# EAGLE design STM32-NRF24L01 (EAGLE 9.5.1)
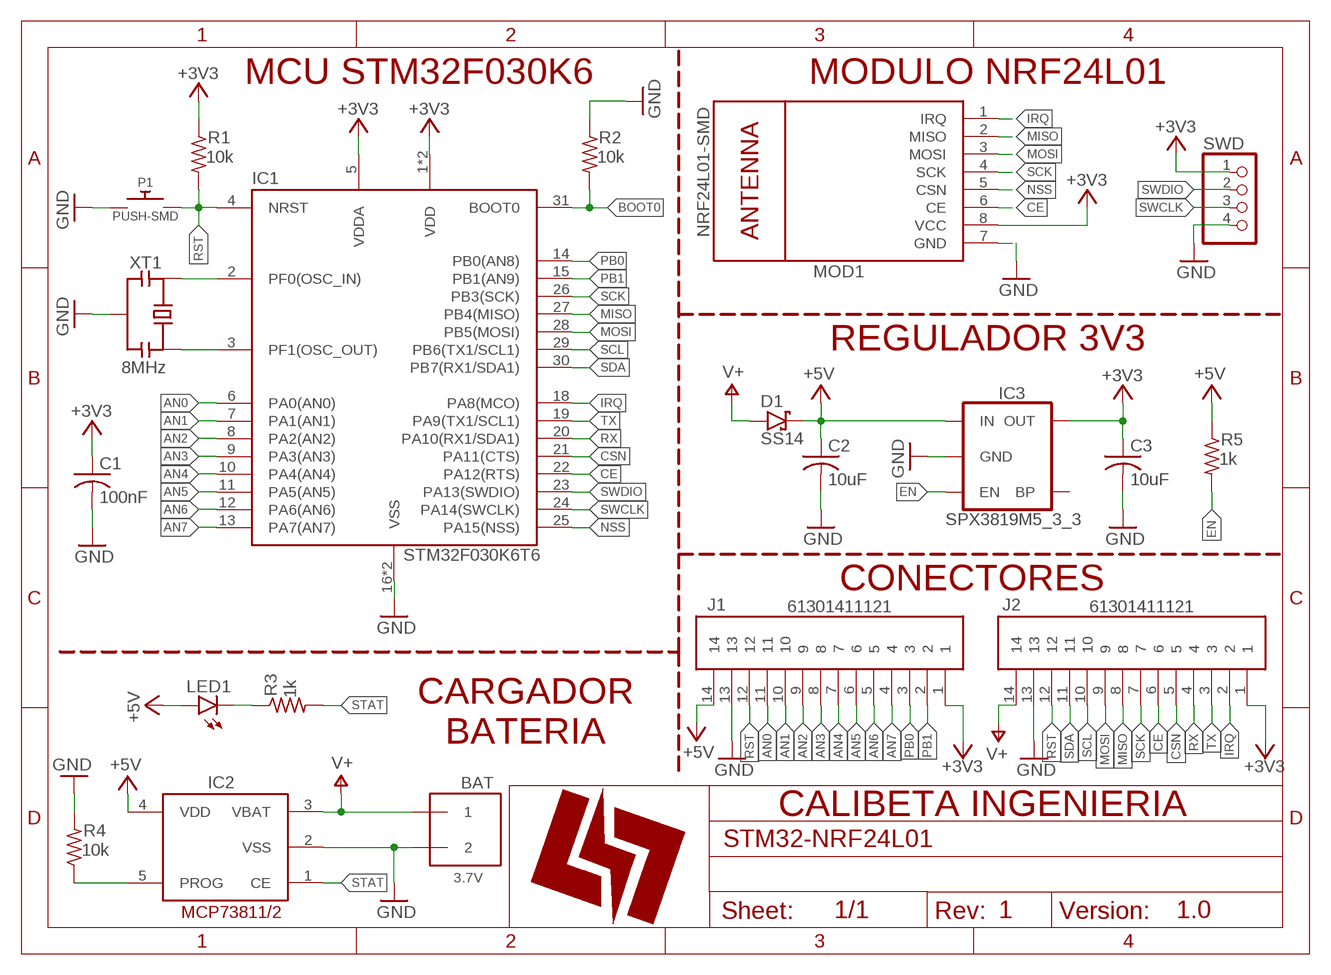
[diagram p0: schematic, sheet 1]

## Parts
BAT  3.7V  JST-2PIN-PH-SM4  [S2B-PH-SM4]
C1  100nF  CAPC0805  [C0805]
C2  10uF  CAPC0805  [C0805]
C3  10uF  CAPC0805  [C0805]
D1  SS14  [DO-214AC]
IC1  STM32F030K6T6  [LQFP32]
IC2  MCP73811/2  [SOT23-5L]
IC3  SPX3819M5_3_3  V_REG_SPX3819-SOT23-5  [SOT23-5]
J1  61301411121  [61301411121]
J2  61301411121  [61301411121]
LED1  LED-ROJO0805  [LED0805-ROJO]
MOD1  NRF24L01-SMD  [NRF24L01-SMD]
P1  PUSH-SMD  PULSADOR-SMD-6035  [ST-SMD-6X3.5MM]
R1  10k  RESISTOR_R0805  [R0805]
R2  10k  RESISTOR_R0805  [R0805]
R3  1k  RESISTOR_R0805  [R0805]
R4  10k  RESISTOR_R0805  [R0805]
R5  1k  RESISTOR_R0805  [R0805]
SWD  PINHD-1X4/90  [1X04/90]
U$1  A5_H-LOGO  [LOGO-10MM]
XT1  8MHz  CSTNE8M00G55-R0  [3-SMD]

## Nets
+3V3: C1.1 C3.1 IC1.1(VDD) IC1.5(VDDA) IC1.17(VDD) IC3.5(OUT) J1.1 J2.1 MOD1.8(VCC) R1.1 SWD.1
+5V: C2.1 D1.K IC2.4(VDD) IC3.1(IN) J1.14 LED1.A R5.1
AN0: IC1.6(PA0(AN0)) J1.11
AN1: IC1.7(PA1(AN1)) J1.10
AN2: IC1.8(PA2(AN2)) J1.9
AN3: IC1.9(PA3(AN3)) J1.8
AN4: IC1.10(PA4(AN4)) J1.7
AN5: IC1.11(PA5(AN5)) J1.6
AN6: IC1.12(PA6(AN6)) J1.5
AN7: IC1.13(PA7(AN7)) J1.4
BOOT0: IC1.31(BOOT0) R2.2
CE: IC1.22(PA12(RTS)) J2.6 MOD1.6(CE)
CSN: IC1.21(PA11(CTS)) J2.5
EN: IC3.3(EN) R5.2
GND: BAT.2 C1.2 C2.2 C3.2 IC1.16(VSS) IC1.32(VSS) IC2.2(VSS) IC3.2(GND) J1.13 J2.13 MOD1.7(GND) P1.1 R2.1 R4.2 SWD.4 XT1.2(GND)
IRQ: IC1.18(PA8(MCO)) J2.2 MOD1.1(IRQ)
MISO: IC1.27(PB4(MISO)) J2.8 MOD1.2(MISO)
MOSI: IC1.28(PB5(MOSI)) J2.9 MOD1.3(MOSI)
N$1: IC1.2(PF0(OSC_IN)) XT1.1(X1)
N$2: IC1.3(PF1(OSC_OUT)) XT1.3(X2)
N$7: LED1.C R3.1
N$8: IC2.5(PROG) R4.1
NSS: IC1.25(PA15(NSS)) MOD1.5(CSN)
PB0: IC1.14(PB0(AN8)) J1.3
PB1: IC1.15(PB1(AN9)) J1.2
RST: IC1.4(NRST) J1.12 J2.12 P1.2 R1.2
RX: IC1.20(PA10(RX1/SDA1)) J2.4
SCK: IC1.26(PB3(SCK)) J2.7 MOD1.4(SCK)
SCL: IC1.29(PB6(TX1/SCL1)) J2.10
SDA: IC1.30(PB7(RX1/SDA1)) J2.11
STAT: IC2.1(CE) R3.2
SWCLK: IC1.24(PA14(SWCLK)) SWD.3
SWDIO: IC1.23(PA13(SWDIO)) SWD.2
TX: IC1.19(PA9(TX1/SCL1)) J2.3
V+: BAT.1 D1.A IC2.3(VBAT) J2.14
Unconnected: IC3.4(BP)

## Notes on the sheet
- MCU STM32F030K6 | MODULO NRF24L01
- REGULADOR 3V3
- CONECTORES
- CARGADOR
  BATERIA
- 1 | 1.0

## Library data of the parts
BAT = CaliBeta-Conectores:JST-2PIN: Conector JST 2mm pitch de 2 pines, Imax 2A Datasheet <http://www.jst-mfg.com/product/pdf/eng/ePH.pdf>
C1-C3 = CaliBeta-RCL:CAP: Capacitor ceramico multicapa
D1 = CaliBeta-Diodos:SS14: Diodo de barrera Schottky (1N5819 SMD) (VRRM): 40V, IRMS: 1A
IC1 = CaliBeta-Microcontroladores:STM32F030K6: Microcontrolador STM de 32 bits, arquitecturs ARM 32KB FLASH 4 KB SRAM 26 General Purpose I/O pins 6-channels 16-bit PWM 10-channels 2-12-bit A/D 1 SPI 1 I2C 1 UART Datasheet <https://www.st.com/resource/en/datasheet/dm00088500.pdf>
IC2 = adafruit:MCP73811/2: MCP73811 and MCP73812 Simple, Miniature Single-Cell, Fully Integrated Li-Ion / Li-Polymer Charge Management Controllers SOT-23-5 package, no indicator LED but with adjustable current, small and very inexpensive
IC3 = SparkFun-IC-Power:V_REG_SPX3819: SPX3819 Voltage Regulator 3.3V 500mA, 16V input Datasheet <https://www.exar.com/content/document.ashx?id=22106> SparkFun Products: SparkFun Serial Controlled Motor Driver <https://www.sparkfun.com/products/13911>; PROD_ID: VREG-13321
J1 J2 = Headers:61301411121: CONN HEADER VERT 14POS 2.54MM Manufacturer's datasheet <https://katalog.we-online.de/em/datasheet/6130xx11121.pdf>; CREATED_BY: PCBLayout.com; DIGIKEY_PART_NUMBER: 732-5325-ND; MANUFACTURER: Wurth Electronics Inc.; MPN: 61301411121
LED1 = CaliBeta-Diodos:LED-ROJO: LED SMD Imax:20mA, color Rojo
MOD1 = CaliBeta-Modulos:NRF24L01: Modulo inalambrico de 2.4GHz basado en el integrado NRF24L01 Mas detalles disponibles aqui: http://www.electrodragon.com/w/NRF24L01
P1 = CaliBeta-Miselaneos:PULSADOR-
R1-R5 = CaliBeta-RCL:RESISTOR_: RESISTOR, simbolo Americano
SWD = pinhead:PINHD-1X4: PIN HEADER
U$1 = CaliBeta-Estilos:A5_H-LOGO
XT1 = CaliBeta-Cristales:CSTNE8M00G55-R0: Crystal ceramico resonador fabricado con capacitor, 8MHz - 33pF, ±0.5% - 40 Ohm Datasheet <https://www.murata.com/~/media/webrenewal/support/library/catalog/products/timingdevice/ceralock/p17e.ashx>

## Board
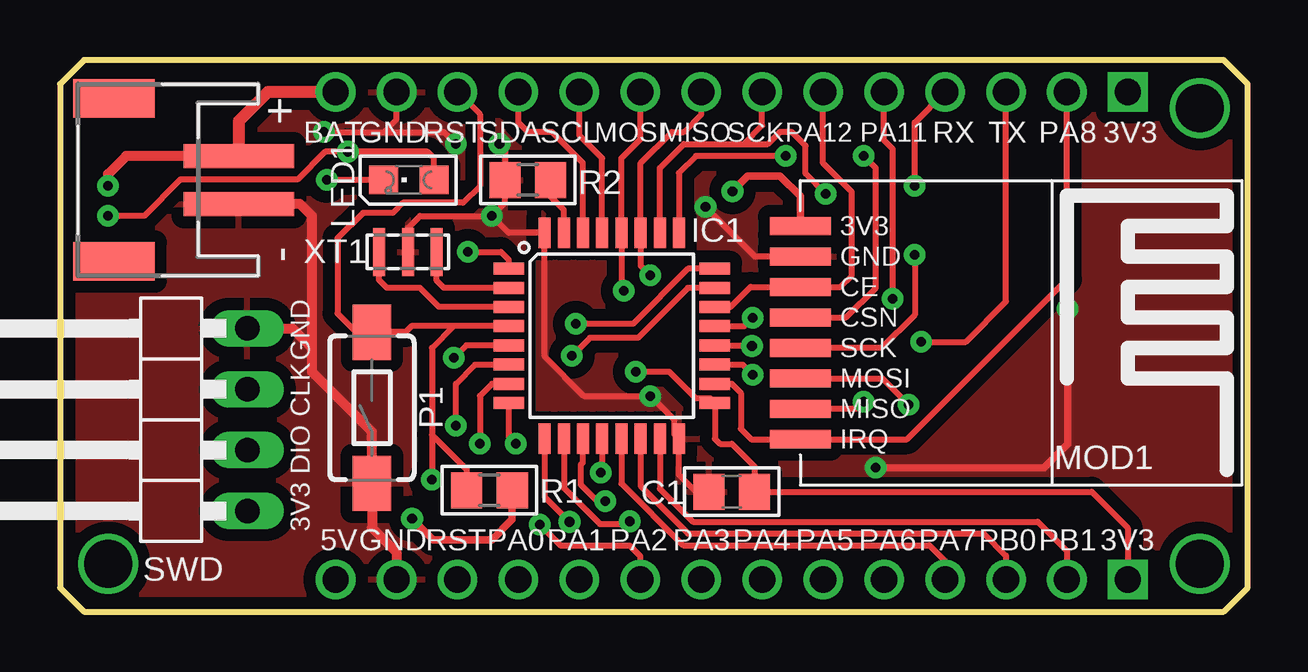
[diagram p1: board, top side]
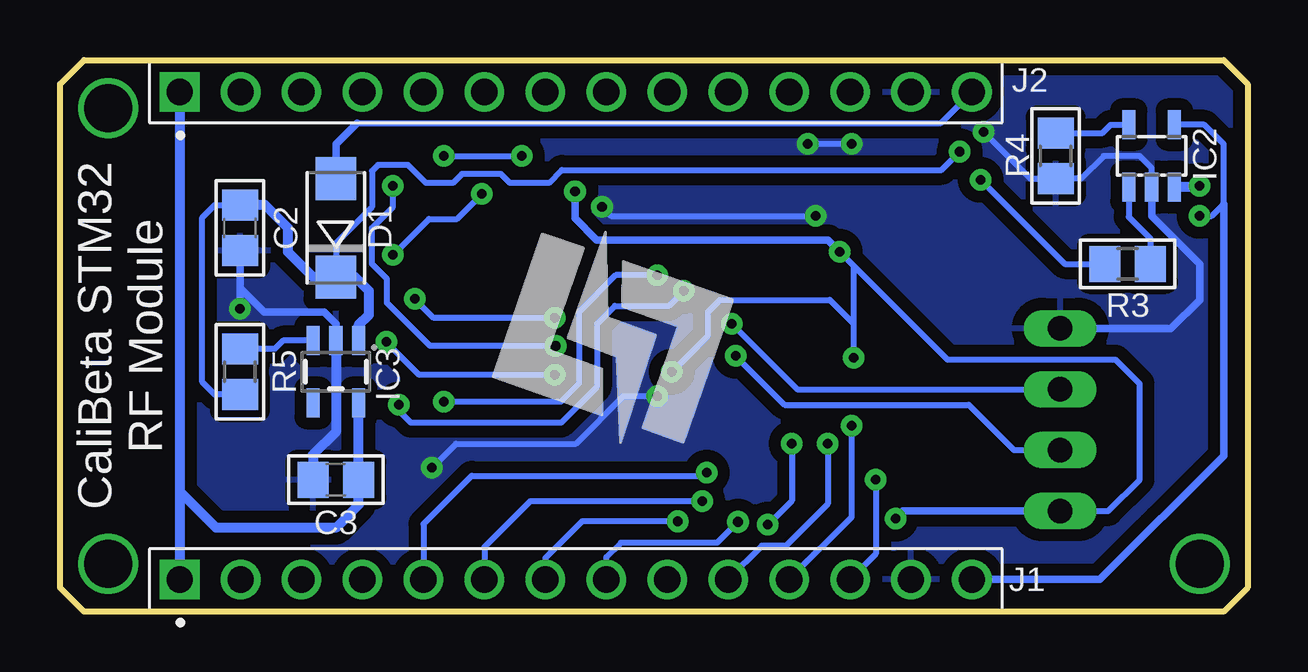
[diagram p2: board, bottom side, seen from below]

Size 49.5 x 23 mm. Coordinates in mm from the lower left corner, seen from the top.
Outline: 1,0 48.5,0 49.5,1 49.5,22 48.5,23 1,23 0,22 0,1 1,0
Copper layers (1*16): Top 0.035mm / dielectric 1.5mm / Bottom 0.035mm
Design rules "China_JLCPCB *": minimum track width 0.25mm, minimum drill 0.4mm, track to track 0.24mm, track to pad 0.23mm, pad to pad 0.2mm, via to via 0.25mm, smd to smd 0.2mm, copper to edge 0.35mm, drill to drill 0.3mm, minimum pad ring 0.25mm, minimum via ring 0.25mm, stop-mask expansion 3mil, vias tented up to drill 0.6mm, thermal gap 20mil

### Footprints (pad centres in the part's own frame; a part is rotated, then mirrored left to right if it is on the bottom)
S2B-PH-SM4 = smd 1 x 4.6: 1 1,-3.7; 2 -1,-3.7 | smd 1.6 x 3.4: NC1 -3.4,1.5; NC2 3.4,1.5
C0805 = smd 1.3 x 1.5: 1 -0.95,0; 2 0.95,0
DO-214AC = smd 1.8 x 1.7: A 2.05,0; K -2.05,0
LQFP32 = smd 1.27 x 0.5: 1 -4.293,2.8; 2 -4.293,2; 3 -4.293,1.2; 4 -4.293,0.4; 5 -4.293,-0.4; 6 -4.293,-1.2; 7 -4.293,-2; 8 -4.293,-2.8; 17 4.293,-2.8; 18 4.293,-2; 19 4.293,-1.2; 20 4.293,-0.4; 21 4.293,0.4; 22 4.293,1.2; 23 4.293,2; 24 4.293,2.8 | smd 0.5 x 1.27: 9 -2.8,-4.293; 10 -2,-4.293; 11 -1.2,-4.293; 12 -0.4,-4.293; 13 0.4,-4.293; 14 1.2,-4.293; 15 2,-4.293; 16 2.8,-4.293; 25 2.8,4.293; 26 2,4.293; 27 1.2,4.293; 28 0.4,4.293; 29 -0.4,4.293; 30 -1.2,4.293; 31 -2,4.293; 32 -2.8,4.293
SOT23-5L = smd 0.55 x 1.2: 1 -0.95,-1.3; 2 0,-1.3; 3 0.95,-1.3; 4 0.95,1.3; 5 -0.95,1.3
SOT23-5 = smd 0.55 x 1.2: 1 -0.95,-1.3; 2 0,-1.3; 3 0.95,-1.3; 4 0.95,1.3; 5 -0.95,1.3
61301411121 = drill 1.1 square: 1 -16.51,0 | drill 1.1: 2 -13.97,0; 3 -11.43,0; 4 -8.89,0; 5 -6.35,0; 6 -3.81,0; 7 -1.27,0; 8 1.27,0; 9 3.81,0; 10 6.35,0; 11 8.89,0; 12 11.43,0; 13 13.97,0; 14 16.51,0
LED0805-ROJO = smd 1.2 x 1.2: A 1.09,0; C -1.01,0
NRF24L01-SMD = smd 2.54 x 0.762: 1 -9.144,-4.318; 2 -9.144,-3.048; 3 -9.144,-1.778; 4 -9.144,-0.508; 5 -9.144,0.762; 6 -9.144,2.032; 7 -9.144,3.302; 8 -9.144,4.572
ST-SMD-6X3.5MM = smd 2.3 x 1.6: 1 -3.15,0; 2 3.15,0
R0805 = smd 1.3 x 1.5: 1 -0.95,0; 2 0.95,0
1X04/90 = drill 1.016 long: 1 -3.81,-3.81; 2 -1.27,-3.81; 3 1.27,-3.81; 4 3.81,-3.81
3-SMD = smd 0.5 x 2: 1 1.2,0; 2 0,0; 3 -1.2,0

### Placement (x,y rotation side)
BAT  3.75,18 90 top
C1  28,5 180 top
C2  42,16 270 bottom
C3  38,5.5 180 bottom
D1  38,16 90 bottom
IC1  23,11.5 0 top
IC2  4,19 0 bottom
IC3  38,10 180 bottom
J1  28,1.34 0 bottom
J2  28,21.66 0 bottom
LED1  14.5,18 0 top
MOD1  40,11.5 0 top
P1  13,8.5 90 top
R1  17.9,5.06 180 top
R2  19.5,18 0 top
R3  5,14.5 0 bottom
R4  8,19 270 bottom
R5  42,10 90 bottom
SWD  4,8 90 top
U$1  26.5,11.5 0 bottom
XT1  14.5,15 0 top

### Tracks (layer width: path | path; a pad name or v marks a point on that pad's centre or on a via)
+3V3  (via drill 0.4)
  Top 0.25: J1.1 44.51,3.49 43,5 C1.1 28.95,6.05 28,7 27.5,7 27.29,7.21 IC1.17 27.1,8.89 26.51,8.89 25.41,10 v24,10 | IC1.5 16.93,11.1 v16.42,10.58 | IC1.1 18.71,14.67 18.38,15 v17,15
  Top 0.305: R1.1 18.85,3.85 18,3 15.55,3 v14.68,3.88 | MOD1.8 30.86,17.31 30.02,18.15 28.66,18.15 v28.03,17.52
  Bottom 0.25: v16.42,10.58 16.42,12 | 16.42,12 16.42,14.42 | 16.42,14.42 v17,15 | SWD.1 5.81,4.19 4.5,5.5 4.5,9.5 5.5,10.5 12.5,10.5 16.42,14.42 | v24,10 22.5,11.5 22.5,12.5 22,13 17.42,13 16.42,12
  Bottom 0.305: v14.68,3.88 14.36,4.19 SWD.1 | v28.03,17.52 28.03,16.4 27.13,15.5 17.5,15.5 v17,15
  Bottom 0.406: IC3.5 C3.1 37.05,4.45 38,3.5 43,3.5 44.51,5.01 | J2.1 44.51,5.01 | 44.51,5.01 J1.1
+5V  (via drill 0.4)
  Top 0.25: v2,16.5 3.5,16.5 5.02,18.02 9.9,18.02 11.05,19.18 v12,19.18 15.32,19.18 15.59,18.91 LED1.A
  Bottom 0.25: v2,16.5 1.5,16.5 1,17 1,19.5 1.8,20.3 IC2.4 | D1.K 38,15.38 36.5,16.88 36.5,18.38 36.25,18.62 35,18.62 34.25,17.88 33.12,17.88 32.75,18.25 31.12,18.25 30.75,17.88 29.12,17.88 28.59,18.41 12.76,18.41 v12,19.18 | R5.1 43.05,9.05 43.57,9.57 43.57,16.43 43.05,16.95 C2.1
  Bottom 0.305: J1.14 6.16,1.34 1,6.5 1,17
  Bottom 0.406: IC3.1 37.05,11.95 36.62,12.38 36.62,13.38 37.2,13.95 D1.K 38.95,13.95 40,15 40,16 40.95,16.95 C2.1
AN0  (via drill 0.4)
  Top 0.25: v16.5,7.75 16.5,9.5 17.3,10.3 IC1.6
  Bottom 0.25: J1.11 16.5,3.95 v16.5,7.75
AN1  (via drill 0.4)
  Top 0.25: IC1.7 18,9.5 17.5,9 v17.5,7
  Bottom 0.25: v17.5,7 17.5,4.5 19.25,2.75 20.25,2.75 J1.10
AN2  (via drill 0.4)
  Top 0.25: IC1.8 18.71,7.29 v19,7 | J1.9 24.19,2.31 23.75,2.75 20.88,2.75 v20,3.62
  Bottom 0.25: v19,7 19,4.62 v20,3.62
AN3  (via drill 0.4)
  Top 0.25: IC1.9 20.2,4.78 v21.24,3.74
  Bottom 0.25: v21.24,3.74 22.11,2.88 26.12,2.88 26.73,2.27 J1.8
AN4  (via drill 0.4)
  Top 0.25: v23.75,3.76 23.64,3.65 22.5,3.65 21,5.15 IC1.10
  Bottom 0.25: v23.75,3.76 27.74,3.76 29.27,2.23 J1.7
AN5  (via drill 0.4)
  Top 0.25: v22.72,4.6 22.4,4.6 21.71,5.29 21.71,6.13 21.8,6.22 IC1.11
  Bottom 0.25: J1.6 31.81,2.69 29.9,4.6 v22.72,4.6
AN6  (via drill 0.4)
  Top 0.25: IC1.12 22.6,5.85 v22.54,5.79
  Bottom 0.25: v22.54,5.79 22.66,5.66 32.34,5.66 34.35,3.65 J1.5
AN7
  Top 0.25: J1.4 36.89,2.11 36.23,2.77 25.97,2.77 23.4,5.34 IC1.13
BOOT0
  Top 0.25: R2.2 20.45,17.3 21,16.75 IC1.31
CE
  Top 0.25: J2.6 31.81,18.69 33,17.5 33,14 32.53,13.53 MOD1.6 28.78,13.53 27.95,12.7 IC1.22
CSN  (via drill 0.4)
  Top 0.25: IC1.21 28.52,11.9 v28.88,12.25 | v34.71,13.04 34.71,19.29 34.35,19.65 J2.5
  Bottom 0.25: v34.71,13.04 33.92,12.25 v28.88,12.25
EN
  Bottom 0.25: IC3.3 40.2,11.3 40.55,10.95 R5.2
GND  (via drill 0.4)
  Top 0.25: C1.2 26.5,5 25.8,5.7 IC1.16 25.61,7.4 25.61,7.99 v24.61,8.98 24.59,9 21.83,9 20.2,10.63 IC1.32 18.71,15.79 v18,16.5 | XT1.2 14.5,16 15,16.5 v18,16.5 | v18,16.5 18.55,17.05 R2.1 18.55,19.27 v18.32,19.5 | 13.5,20 14.03,20.53 J2.13 | v11,20 13.5,20 | MOD1.7 28.98,14.8 v26.91,16.88 | 13.5,20 16,20 v16.5,19.5
  Top 0.305: v42,12.62 42,7 41,6 v34,6
  Top 0.406: J1.13 14.03,2.47 13,3.5 P1.1 13,7.5 10.5,10 10.5,11 | BAT.2 10,17 10.5,16.5 10.5,11 | SWD.4 9.69,11.81 10.5,11
  Bottom 0.25: v26.91,16.88 26.53,16.5 v18,16.5 | IC2.2 4,18.5 4.5,19 6,19 6.95,18.05 R4.2 9.05,18.05 v11,20 | v34,6 33,7 28,7 26.02,8.98 v24.61,8.98 | v16.5,19.5 v18.32,19.5
  Bottom 0.305: C2.2 42,13.5 | 42,13.5 41,12.5 38.5,12.5 38,12 IC3.2 | IC2.2 4,16.5 2,14.5 2,13 3.19,11.81 SWD.4 | 42,13.5 v42,12.62
  Bottom 0.406: IC3.2 38,7.5 38.95,6.55 C3.2
  pour Top (isolate 0.5, rank 3): 1,-0.5 -0.5,1 -0.5,22 1,23.5 48.5,23.5 50,22 50,0.5 49,-0.5
  pour Bottom (isolate 0.5, rank 3): 1,-1 -1,1 -1,22.5 0.5,24 48.5,24 50.5,22 50.5,1 48.5,-1
IRQ
  Top 0.25: IC1.18 28,9.5 28.38,9.12 28.38,7.62 28.82,7.18 MOD1.1 35.31,7.18 41.97,13.85 J2.2
MISO  (via drill 0.4)
  Top 0.25: J2.8 26.73,20.73 26,20 25.5,20 24.2,18.7 IC1.27 24.2,14.43 v24.6,14.02 | v33.5,8.75 33.2,8.45 MOD1.2
  Bottom 0.25: v33.5,8.75 28.62,8.75 27.86,9.52 27.86,12.5 26.33,14.02 v24.6,14.02
MOSI  (via drill 0.4)
  Top 0.25: J2.9 24.19,19.69 23.4,18.9 IC1.28 23.4,13.47 v23.5,13.38 | MOD1.3 34.28,9.72 v35.38,8.62
  Bottom 0.25: v35.38,8.62 35.38,8.38 34.88,7.88 28.62,7.88 27.12,9.38 27.12,12 26.38,12.75 24.12,12.75 v23.5,13.38
N$1
  Top 0.25: IC1.2 16,13.5 15.7,13.8 XT1.1
N$2
  Top 0.25: IC1.3 15.8,12.7 15,13.5 13.62,13.5 13.3,13.82 XT1.3
N$3  (via drill 2)
  other vias: 47.5,2
N$4  (via drill 2)
  other vias: 47.5,21
N$5  (via drill 2)
  other vias: 2,2
N$7  (via drill 0.4)
  Top 0.25: LED1.C v11.12,18
  Bottom 0.25: v11.12,18 7.62,14.5 R3.1
N$8
  Bottom 0.25: R4.1 6.05,19.95 5.7,20.3 IC2.5
NSS  (via drill 0.4)
  Top 0.25: MOD1.5 32.76,12.26 34,13.5 34,18.5 v33.5,19 | v30.25,19 26.5,19 25.8,18.3 IC1.25
  Bottom 0.25: v33.5,19 v30.25,19
PB0
  Top 0.25: J1.3 39.43,2.33 38.5,3.26 26.17,3.26 24.2,5.23 IC1.14
PB1
  Top 0.25: IC1.15 25,5.12 26.38,3.75 40.75,3.75 41.97,2.53 J1.2
RST  (via drill 0.4)
  Top 0.25: IC1.4 16.4,11.9 | 16.4,11.9 14.65,11.9 14.4,11.65 P1.2 12.35,11.65 11.57,12.43 11.57,15.57 12.62,16.62 13.88,16.62 14.29,17.05 16.8,17.05 17.5,17.75 17.5,20.73 J2.12 | 15.5,7.38 15.5,11 16.4,11.9 | 15.5,7.38 16.95,5.92 R1.2 | 15.5,7.38 v15.5,5.5
  Bottom 0.25: v15.5,5.5 15.5,2.41 J1.12
RX  (via drill 0.4)
  Top 0.25: IC1.20 28.82,11.1 v28.84,11.07 | v35.62,17.75 35.62,20.39 J2.4
  Bottom 0.25: v28.84,11.07 34.08,11.07 35.88,12.88 35.88,13.88 36.5,14.5 36.5,16 35.62,16.88 v35.62,17.75
SCK  (via drill 0.4)
  Top 0.25: IC1.26 25,18.5 26,19.5 28.5,19.5 | J2.7 29.27,20.27 28.5,19.5 | v35.62,14.88 35.62,12.38 34.24,10.99 MOD1.4 | 28.5,19.5 29.5,19.5 30,20 30.5,20 31.07,19.43 31.07,18.26 v31.92,17.42
  Bottom 0.25: v35.62,14.88 34.12,16.38 32.96,16.38 v31.92,17.42
SCL
  Top 0.25: IC1.29 22.6,18.9 21.65,19.85 J2.10
SDA
  Top 0.25: IC1.30 21.8,18.7 20.5,20 19.5,20 19.11,20.39 J2.11
STAT
  Bottom 0.25: IC2.1 4.95,16.45 4.05,15.55 R3.2
SWCLK  (via drill 0.4)
  Top 0.25: IC1.24 26.18,14.3 23.88,12 v21.5,12
  Bottom 0.25: v21.5,12 18.77,9.27 SWD.3
SWDIO  (via drill 0.4)
  Top 0.25: IC1.23 26.17,13.5 24.08,11.42 22.08,11.42 v21.33,10.67
  Bottom 0.25: v21.33,10.67 19.29,8.62 11.62,8.62 9.73,6.73 SWD.2
TX  (via drill 0.4)
  Top 0.25: IC1.19 28.45,10.3 v28.88,9.88 | v35.9,11.25 37.75,11.25 39.43,12.93 J2.3
  Bottom 0.25: v28.88,9.88 34.52,9.88 v35.9,11.25
V+  (via drill 0.4)
  Top 0.406: BAT.1 2.75,19 2,18.25 v2,17.75
  Top 0.508: J2.14 8.66,21.66 7.45,20.45 BAT.1
  Bottom 0.25: J2.14 12.78,20.38 37.12,20.38
  Bottom 0.305: D1.A 38,19.5 37.12,20.38
  Bottom 0.406: v2,17.75 2.05,17.7 IC2.3

### Text on the board
tPlace: BAT | GND | RST | SDA | SCL | MOSI | MISO | SCK | PA12 | PA11 | RX | TX | PA8 | 3V3 | GND | CLK | DIO | 3V3 | 5V | GND | RST | PA0 | PA1 | PA2 | PA3 | PA4 | PA5 | PA6 | PA7 | PB0 | PB1 | 3V3
bPlace: CaliBeta STM32 / RF Module